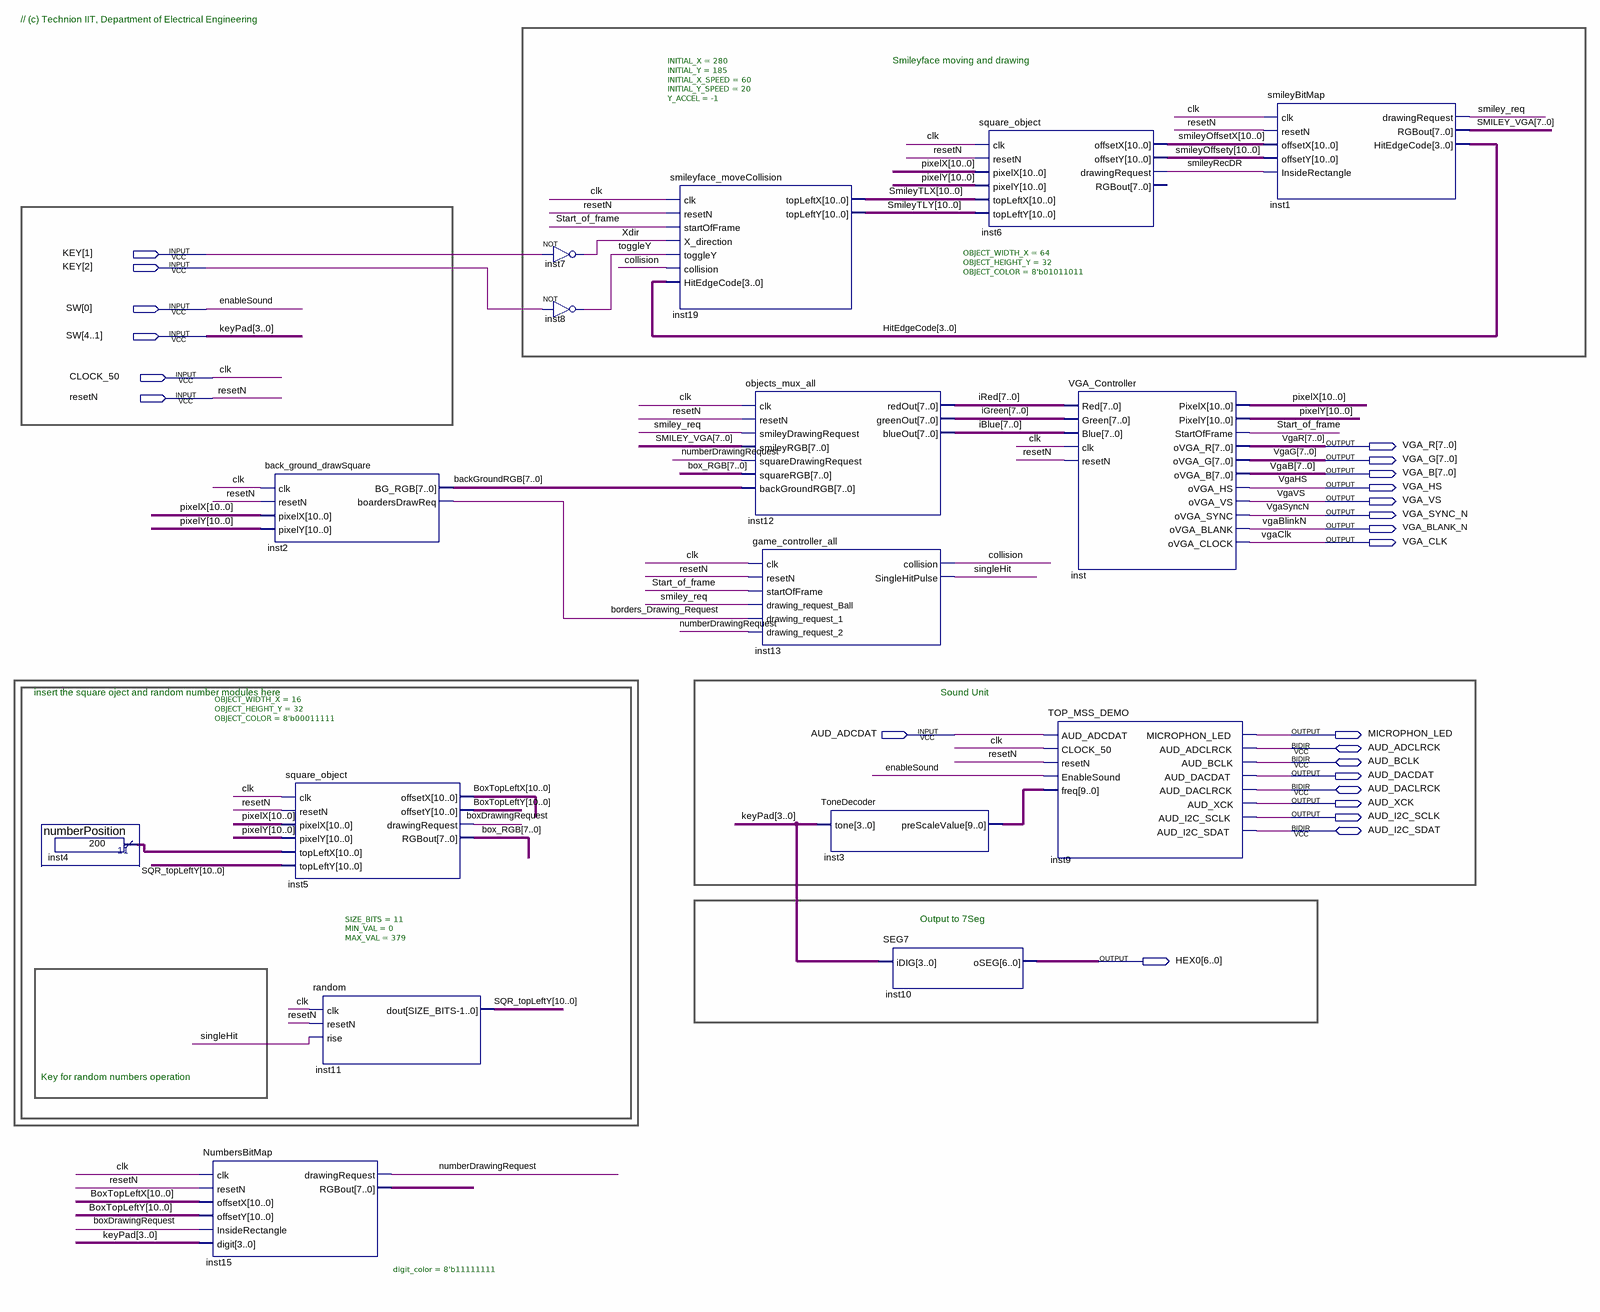
[diagram p0: schematic sheet]
// Quartus schematic TOP_VGA_DEMO_noKBD.bdf as structural Verilog: 16 symbols, 24 pins
module TOP_VGA_DEMO_noKBD (
  input  [2:1] KEY,
  input  [4:0] SW,
  input  CLOCK_50,
  input  resetN,
  input  AUD_ADCDAT,
  inout  AUD_ADCLRCK,
  inout  AUD_BCLK,
  inout  AUD_DACLRCK,
  inout  AUD_I2C_SDAT,
  output [7:0] VGA_R,
  output [7:0] VGA_G,
  output [7:0] VGA_B,
  output VGA_HS,
  output VGA_VS,
  output VGA_SYNC_N,
  output VGA_BLANK_N,
  output VGA_CLK,
  output MICROPHON_LED,
  output AUD_DACDAT,
  output AUD_XCK,
  output AUD_I2C_SCLK,
  output [6:0] HEX0
);

  wire borders_Drawing_Request, boxDrawingRequest, collision, numberDrawingRequest, singleHit, smiley_req,
       smileyRecDR, Start_of_frame, toggleY, Xdir;
  wire [3:0] HitEdgeCode;
  wire [7:0] backGroundRGB, box_RGB, iBlue, iGreen, inst15_rgbout, iRed, SMILEY_VGA;
  wire [9:0] inst3_prescalevalue;
  wire [10:0] BoxTopLeftX, BoxTopLeftY, inst4_result, pixelX, pixelY, smileyOffsetX, smileyOffsety,
       SmileyTLX, SmileyTLY, SQR_topLeftY;

  numberPosition inst4 (.result(inst4_result));
  NumbersBitMap #(.digit_color(8'b11111111)) inst15 (
    .clk(CLOCK_50), .resetN(resetN), .offsetX(BoxTopLeftX), .offsetY(BoxTopLeftY),
    .InsideRectangle(boxDrawingRequest), .digit(SW[4:1]), .drawingRequest(numberDrawingRequest),
    .RGBout(inst15_rgbout));
  back_ground_drawSquare inst2 (
    .clk(CLOCK_50), .resetN(resetN), .pixelX(pixelX), .pixelY(pixelY), .BG_RGB(backGroundRGB),
    .boardersDrawReq(borders_Drawing_Request));
  square_object #(.OBJECT_WIDTH_X(16), .OBJECT_HEIGHT_Y(32), .OBJECT_COLOR(8'b00011111)) inst5 (
    .clk(CLOCK_50), .resetN(resetN), .pixelX(pixelX), .pixelY(pixelY), .topLeftX(inst4_result),
    .topLeftY(SQR_topLeftY), .offsetX(BoxTopLeftX), .offsetY(BoxTopLeftY),
    .drawingRequest(boxDrawingRequest), .RGBout(box_RGB));
  random #(.SIZE_BITS(11), .MIN_VAL(0), .MAX_VAL(379)) inst11 (
    .clk(CLOCK_50), .resetN(resetN), .rise(singleHit), .dout(SQR_topLeftY));
  not inst7 (Xdir, KEY[1]);
  not inst8 (toggleY, KEY[2]);
  smileyface_moveCollision #(.INITIAL_X(280), .INITIAL_Y(185), .INITIAL_X_SPEED(60), .INITIAL_Y_SPEED(20), .Y_ACCEL(-1)) inst19 (
    .clk(CLOCK_50), .resetN(resetN), .startOfFrame(Start_of_frame), .X_direction(Xdir), .toggleY(toggleY),
    .collision(collision), .HitEdgeCode(HitEdgeCode), .topLeftX(SmileyTLX), .topLeftY(SmileyTLY));
  objects_mux_all inst12 (
    .clk(CLOCK_50), .resetN(resetN), .smileyDrawingRequest(smiley_req), .smileyRGB(SMILEY_VGA),
    .squareDrawingRequest(numberDrawingRequest), .squareRGB(box_RGB), .backGroundRGB(backGroundRGB),
    .redOut(iRed), .greenOut(iGreen), .blueOut(iBlue));
  game_controller_all inst13 (
    .clk(CLOCK_50), .resetN(resetN), .startOfFrame(Start_of_frame), .drawing_request_Ball(smiley_req),
    .drawing_request_1(borders_Drawing_Request), .drawing_request_2(numberDrawingRequest),
    .collision(collision), .SingleHitPulse(singleHit));
  ToneDecoder inst3 (.tone(SW[4:1]), .preScaleValue(inst3_prescalevalue));
  SEG7 inst10 (.iDIG(SW[4:1]), .oSEG(HEX0));
  square_object #(.OBJECT_WIDTH_X(64), .OBJECT_HEIGHT_Y(32), .OBJECT_COLOR(8'b01011011)) inst6 (
    .clk(CLOCK_50), .resetN(resetN), .pixelX(pixelX), .pixelY(pixelY), .topLeftX(SmileyTLX),
    .topLeftY(SmileyTLY), .offsetX(smileyOffsetX), .offsetY(smileyOffsety), .drawingRequest(smileyRecDR));  // open: RGBout
  VGA_Controller inst (
    .Red(iRed), .Green(iGreen), .Blue(iBlue), .clk(CLOCK_50), .resetN(resetN), .PixelX(pixelX),
    .PixelY(pixelY), .StartOfFrame(Start_of_frame), .oVGA_R(VGA_R), .oVGA_G(VGA_G), .oVGA_B(VGA_B),
    .oVGA_HS(VGA_HS), .oVGA_VS(VGA_VS), .oVGA_SYNC(VGA_SYNC_N), .oVGA_BLANK(VGA_BLANK_N), .oVGA_CLOCK(VGA_CLK));
  TOP_MSS_DEMO inst9 (
    .AUD_ADCDAT(AUD_ADCDAT), .CLOCK_50(CLOCK_50), .resetN(resetN), .EnableSound(SW[0]),
    .freq(inst3_prescalevalue), .MICROPHON_LED(MICROPHON_LED), .AUD_DACDAT(AUD_DACDAT), .AUD_XCK(AUD_XCK),
    .AUD_I2C_SCLK(AUD_I2C_SCLK), .AUD_ADCLRCK(AUD_ADCLRCK), .AUD_BCLK(AUD_BCLK), .AUD_DACLRCK(AUD_DACLRCK),
    .AUD_I2C_SDAT(AUD_I2C_SDAT));
  smileyBitMap inst1 (
    .clk(CLOCK_50), .resetN(resetN), .offsetX(smileyOffsetX), .offsetY(smileyOffsety),
    .InsideRectangle(smileyRecDR), .drawingRequest(smiley_req), .RGBout(SMILEY_VGA), .HitEdgeCode(HitEdgeCode));

  // Other names for the same wires on the sheet: clk = CLOCK_50; enableSound = SW[0]; keyPad[3:0] = SW[4:1];
  //   VgaB[7:0] = VGA_B; vgaBlinkN = VGA_BLANK_N; vgaClk = VGA_CLK; VgaG[7:0] = VGA_G; VgaHS = VGA_HS;
  //   VgaR[7:0] = VGA_R; VgaSyncN = VGA_SYNC_N; VgaVS = VGA_VS

  // Notes on the sheet:
  //   // (c) Technion IIT, Department of Electrical Engineering 
  //   Smileyface moving and drawing
  //   insert the square oject and random number modules here
  //   Sound Unit
  //   Output to 7Seg
  //   Key for random numbers operation
endmodule
